# EAGLE design NixieModule_IN12 (EAGLE 9.1.3)
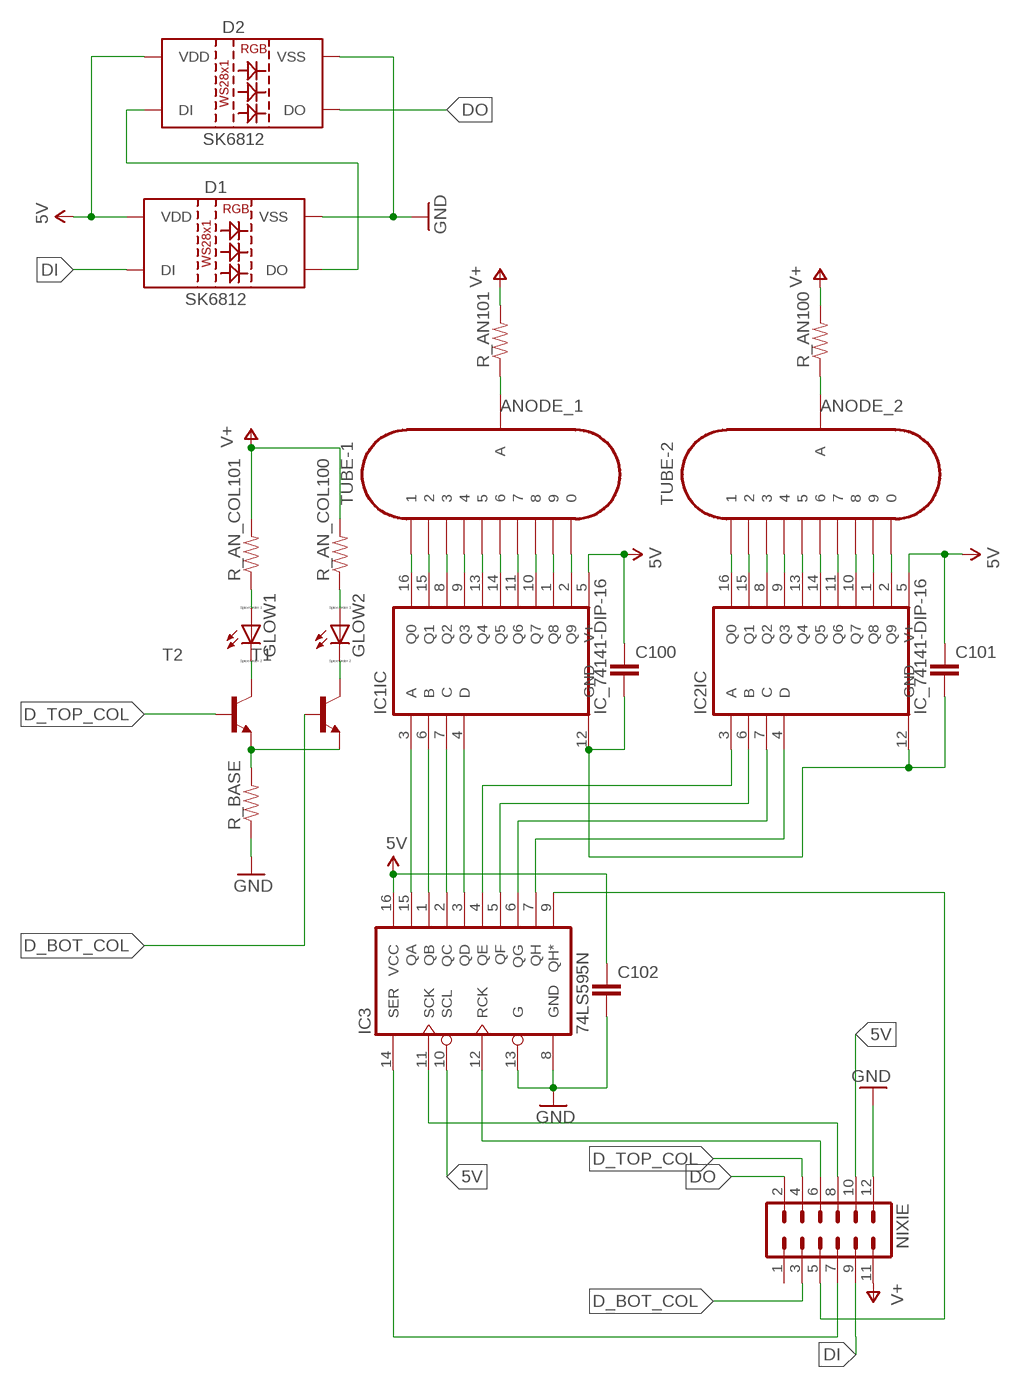
[diagram p0: schematic, sheet 1]

## Parts
C100  C-EU050-024X044  [C050-024X044]
C101  C-EU050-024X044  [C050-024X044]
C102  C-EU050-024X044  [C050-024X044]
D1  SK6812  WS2812B  [WS2812B]
D2  SK6812  WS2812B  [WS2812B]
GLOW1  LED_ELD260  [LED_LD260]
GLOW2  LED_ELD260  [LED_LD260]
IC1  IC_74141-DIP-16  [DIL16]
IC2  IC_74141-DIP-16  [DIL16]
IC3  74LS595N  [DIL16]
NIXIE  MA06-2  [MA06-2]
R_AN100  RESISTORPTH-1/4W  [AXIAL-0.4]
R_AN101  RESISTORPTH-1/4W  [AXIAL-0.4]
R_AN_COL100  RESISTORPTH-1/4W  [AXIAL-0.4]
R_AN_COL101  RESISTORPTH-1/4W  [AXIAL-0.4]
R_BASE  RESISTORPTH-1/4W  [AXIAL-0.4]
T1  -NPN-TO92-EBC  [TO92-EBC]
T2  -NPN-TO92-EBC  [TO92-EBC]
TUBE-1  IN-12A  [IN-12]
TUBE-2  IN-12A  [IN-12]

## Nets
5V: C100.1 C101.1 C102.1 D1.1(VDD) D2.1(VDD) IC1.5(SUPPLY:V+) IC2.5(SUPPLY:V+) IC3.10(SCL) IC3.16(VCC) NIXIE.10
ANODE_1 [High Voltage 170V]: R_AN101.P$1 TUBE-1.A
ANODE_2 [High Voltage 170V]: R_AN100.P$1 TUBE-2.A
D_BOT_COL: NIXIE.3 T1.B
D_TOP_COL: NIXIE.4 T2.B
DI: D1.4(DI) NIXIE.9
DO: D2.2(DO) NIXIE.2
GND [High Voltage 170V]: C100.2 C101.2 C102.2 D1.3(VSS) D2.3(VSS) IC1.12(SUPPLY:GND) IC2.12(SUPPLY:GND) IC3.8(GND) IC3.13(G) NIXIE.12 R_BASE.P$1
N$1: GLOW1.A R_AN_COL101.P$1
N$2: GLOW2.A R_AN_COL100.P$1
N$6: GLOW1.K(C) T2.C
N$7: IC1.16(IC:Q0) TUBE-1.1
N$8 [High Voltage 60V]: IC1.15(IC:Q1) TUBE-1.2
N$9 [High Voltage 60V]: IC1.8(IC:Q2) TUBE-1.3
N$10 [High Voltage 60V]: IC1.9(IC:Q3) TUBE-1.4
N$11 [High Voltage 60V]: IC1.13(IC:Q4) TUBE-1.5
N$12 [High Voltage 60V]: IC1.14(IC:Q5) TUBE-1.6
N$13 [High Voltage 60V]: IC1.11(IC:Q6) TUBE-1.7
N$14 [High Voltage 60V]: IC1.10(IC:Q7) TUBE-1.8
N$15 [High Voltage 60V]: IC1.1(IC:Q8) TUBE-1.9
N$16 [High Voltage 60V]: IC1.2(IC:Q9) TUBE-1.0
N$17: GLOW2.K(C) T1.C
N$18: R_BASE.P$2 T1.E T2.E
N$20 [High Voltage 60V]: IC2.9(IC:Q3) TUBE-2.4
N$21 [High Voltage 60V]: IC2.13(IC:Q4) TUBE-2.5
N$22 [High Voltage 60V]: IC2.14(IC:Q5) TUBE-2.6
N$23 [High Voltage 60V]: IC2.11(IC:Q6) TUBE-2.7
N$24 [High Voltage 60V]: IC2.10(IC:Q7) TUBE-2.8
N$25 [High Voltage 60V]: IC2.1(IC:Q8) TUBE-2.9
N$26 [High Voltage 60V]: IC2.2(IC:Q9) TUBE-2.0
N$27: D1.2(DO) D2.4(DI)
N$71: IC1.6(IC:B) IC3.1(QB)
N$72: IC1.7(IC:C) IC3.2(QC)
N$73: IC1.4(IC:D) IC3.3(QD)
N$74: IC1.3(IC:A) IC3.15(QA)
N$79: IC2.3(IC:A) IC3.4(QE)
N$80: IC2.6(IC:B) IC3.5(QF)
N$81: IC2.7(IC:C) IC3.6(QG)
N$82: IC2.4(IC:D) IC3.7(QH)
RCK: IC3.12(RCK) NIXIE.6
SCK: IC3.11(SCK) NIXIE.8
SERIAL_SHIFT_IN: IC3.14(SER) NIXIE.7
SERIAL_SHIFT_OUT: IC3.9(QH*) NIXIE.5
T2_1 [High Voltage 60V]: IC2.16(IC:Q0) TUBE-2.1
T2_2 [High Voltage 60V]: IC2.15(IC:Q1) TUBE-2.2
T2_3 [High Voltage 60V]: IC2.8(IC:Q2) TUBE-2.3
V+ [High Voltage 170V]: NIXIE.11 R_AN100.P$2 R_AN101.P$2 R_AN_COL100.P$2 R_AN_COL101.P$2
Unconnected: NIXIE.1

## Library data of the parts
C100-C102 = rcl:C-EU: CAPACITOR, European symbol; SPICEPREFIX: C
D1 D2 = SparkFun-LED:WS2812B: WS2812B SMD addressable RGB LED 5x5mm SMD LED with built-in controller IC. Color: Red/Green/Blue mC Rating: RGB: 390, 660, 180 mcd Forward Voltage: RGB: 2.0, 3.0, 3.0 V Packages:WS2812B SparkFun Products: Blynk Board - ESP8266 <https://www.sparkfun.com/products/13794>; PROD_ID: DIO-12503; VALUE: WS2812B
GLOW1 GLOW2 = eagle-ltspice:LED_E: LED Source: http://www.osram.convergy.de Source: www.luxeon.com Source: www.kingbright.com; SPICEMODEL: NONE; SPICEPREFIX: D; SPICETYPE: diode
IC1 IC2 = dp_devices:IC_74141: BCD to decimal decoder
IC3 = SparkFun:74*595: 8-bit SHIFT REGISTER, output latch
NIXIE = con-lstb:MA06-2: PIN HEADER; OC_FARNELL: unknown; OC_NEWARK: unknown
R_AN100 R_AN101 R_AN_COL100 R_AN_COL101 R_BASE = SparkFun:RESISTOR: Resistor Basic schematic elements and footprints for 0603, 1206, and PTH resistors.
T1 T2 = transistor:*-NPN-: NPN Transistror BF959 corrected 2008.03.06
TUBE-1 TUBE-2 = russian-nixies:IN-12A: IN-12A: medium numeric topview nixie tube

## Net classes
0 default: width 0.305 mm, clearance 0.305 mm
1 High Voltage 170V: width 0.61 mm, clearance 0.205 mm to class 0, clearance 0.61 mm
2 High Voltage 60V: width 0.406 mm, clearance 0.205 mm to class 0, clearance 0.205 mm to class 1, clearance 0.406 mm

## Board
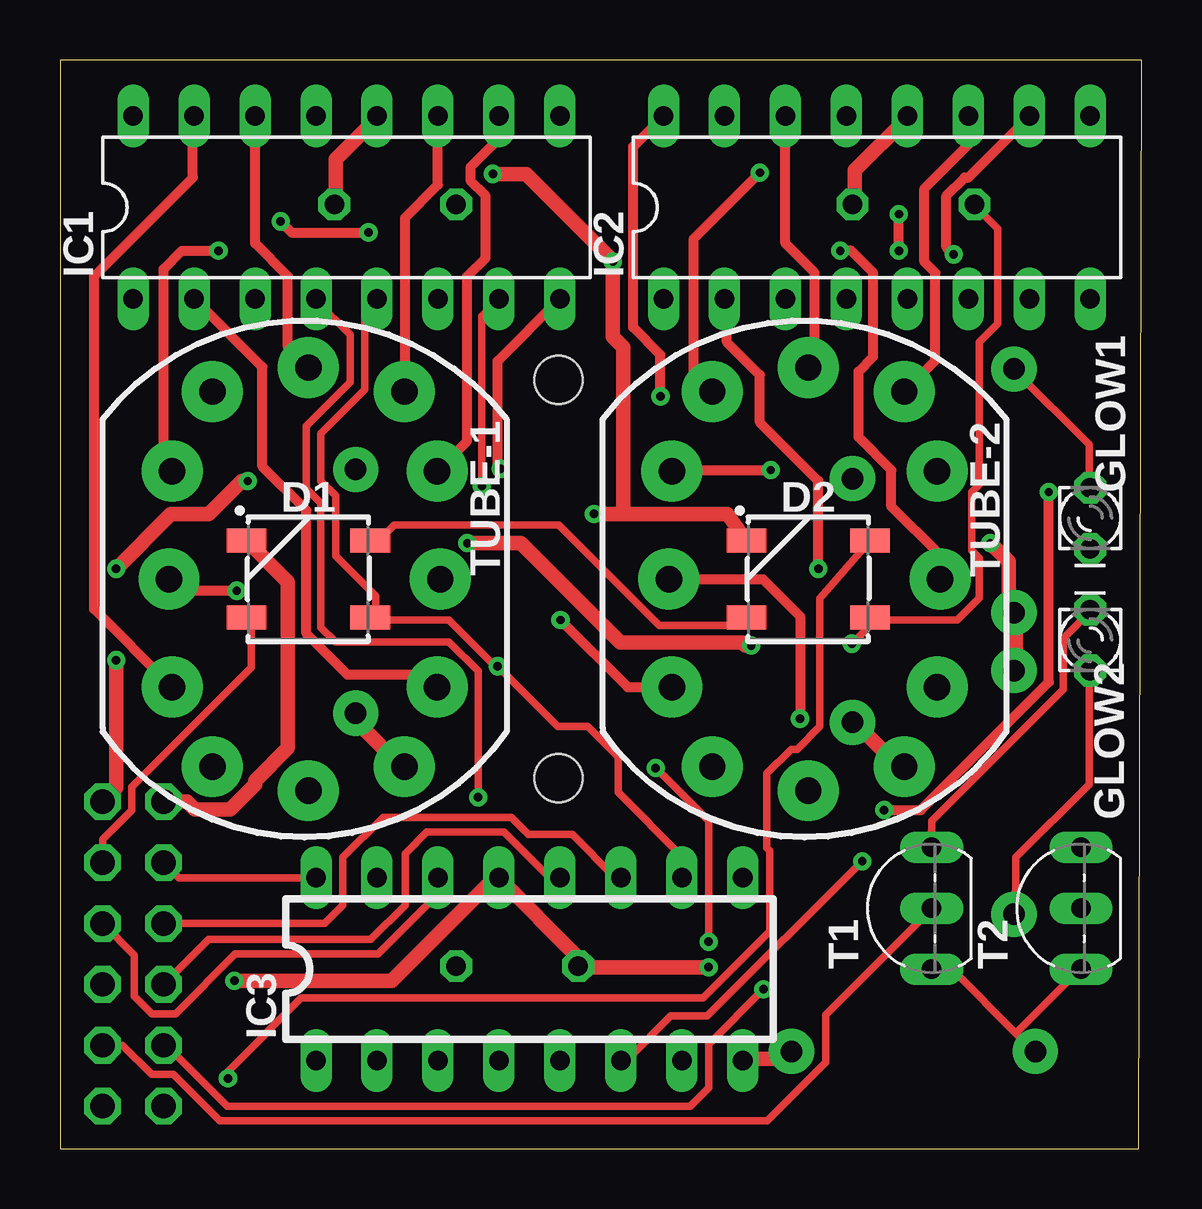
[diagram p1: board, top side]
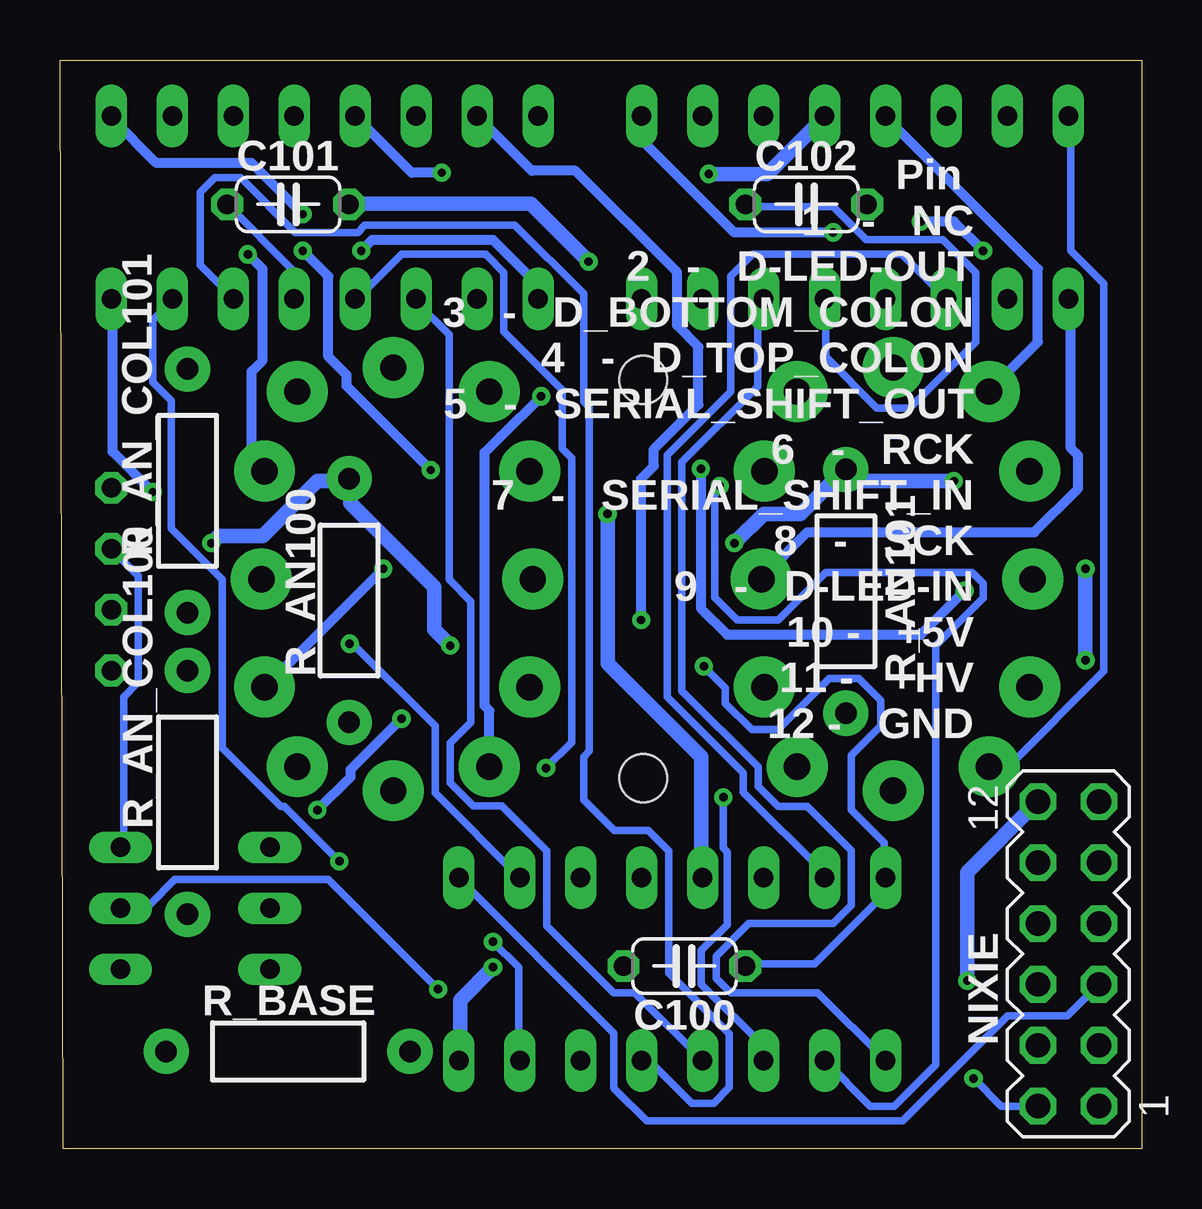
[diagram p2: board, bottom side, seen from below]

Size 45.06 x 45.39 mm. Coordinates in mm from the lower left corner, seen from the top.
Outline: 0,0 44.94,0 45.06,45.39 0,45.39 0,0
Copper layers (1*16): Top 0.035mm / dielectric 1.5mm / Bottom 0.035mm
Design rules "default": minimum track width 6mil, minimum drill 0.35mm, track to track 6mil, track to pad 6mil, pad to pad 6mil, via to via 6mil, smd to smd 6mil, copper to edge 40mil, drill to drill 6mil, minimum pad ring 10mil, minimum via ring 8mil, stop-mask expansion 4mil, vias tented up to drill 0mil, thermal gap 10mil
Holes 2 mm at 20.76,32.05 20.76,15.45

### Footprints (pad centres in the part's own frame; a part is rotated, then mirrored left to right if it is on the bottom)
C050-024X044 = drill 0.813 octagon: 1 -2.54,0; 2 2.54,0
WS2812B = smd 1.651 x 1: 1 2.577,-1.6; 2 2.577,1.6; 3 -2.577,1.6; 4 -2.577,-1.6
LED_LD260 = drill 0.813 octagon: A -1.27,0; K 1.27,0
DIL16 = drill 0.813 long: 1 -8.89,-3.81; 2 -6.35,-3.81; 3 -3.81,-3.81; 4 -1.27,-3.81; 5 1.27,-3.81; 6 3.81,-3.81; 7 6.35,-3.81; 8 8.89,-3.81; 9 8.89,3.81; 10 6.35,3.81; 11 3.81,3.81; 12 1.27,3.81; 13 -1.27,3.81; 14 -3.81,3.81; 15 -6.35,3.81; 16 -8.89,3.81
MA06-2 = drill 1.016 octagon: 1 -6.35,-1.27; 2 -6.35,1.27; 3 -3.81,-1.27; 4 -3.81,1.27; 5 -1.27,-1.27; 6 -1.27,1.27; 7 1.27,-1.27; 8 1.27,1.27; 9 3.81,-1.27; 10 3.81,1.27; 11 6.35,-1.27; 12 6.35,1.27
AXIAL-0.4 = drill 0.9 pad 1.88: P$1 -5.08,0; P$2 5.08,0
TO92-EBC = drill 0.813 long: B 0,-1.27; C 2.54,-1.27; E -2.54,-1.27
IN-12 = drill 1.1 pad 2.54: 0 5.048,-4.5; 1 -4.317,-7.817; 2 -6,-4.5; 3 -6.127,0; 4 -6,4.5; 5 -4.317,7.817; 6 -0.318,8.818; 7 3.683,7.817; 8 5.048,4.5; 9 5.175,0; A 3.683,-7.817; LHDP -0.318,-8.818

### Placement (x,y rotation side)
C100  19.05,7.62 180 bottom
C101  35.56,39.37 0 bottom
C102  13.97,39.37 0 bottom
D1  10.35,23.75 0 top
D2  31.18,23.75 0 top
GLOW1  42.93,26.29 270 top
GLOW2  42.93,21.21 90 top
IC1  11.94,39.24 0 top
IC2  34.04,39.24 0 top
IC3  19.56,7.49 0 top
NIXIE  3.05,8.13 90 bottom
R_AN100  33.02,22.86 90 bottom
R_AN101  12.32,23.24 90 bottom
R_AN_COL100  39.75,14.86 90 bottom
R_AN_COL101  39.75,27.43 270 bottom
R_BASE  35.56,4.06 180 bottom
T1  35.05,10.03 90 top
T2  41.27,10.03 90 top
TUBE-1  10.67,23.75 0 top
TUBE-2  31.5,23.75 0 top

### Tracks (layer width: path | path; a pad name or v marks a point on that pad's centre or on a via)
5V  (via drill 0.35)
  Top 0.305: C101.1 38.15,39.27 39.06,38.35 39.06,34.39 38.3,33.63 38.3,27.69 38,27.38 38,24.94 38.3,24.64 38.3,22.96 37.39,22.05 34.19,22.05 D2.1 34.04,22.05 33.98,22.05 v32.99,21.06 | IC1.5 13.16,35.31 12.7,34.85 12.7,31.65 10.87,29.82 10.87,27.84 11.48,27.23 11.48,24.71 13.16,23.04 13.16,22.2 D1.1 13.31,22.05 16.2,22.05 18.19,20.07 v18.24,20.12 20.74,17.62 21.98,17.62 23.25,16.35 23.25,14.85 25.91,12.19 IC3.10 | NIXIE.10 4.95,11.3 IC3.16
  Bottom 0.305: C101.1 35.41,36.68 35.41,35.46 IC2.5 | C100.1 16.51,7.72 13.61,7.72 10.72,10.62 10.72,11.23 IC3.16 10.72,11.38 10.72,12.75 12.09,14.12 12.09,16.41 10.87,17.63 10.87,18.69 11.79,19.61 13.01,19.61 15.14,17.48 16.24,17.48 17.34,18.57 17.34,19.22 v18.24,20.12 | C102.1 16.51,39.27 12.85,39.27 11.48,37.9 8.28,37.9 6.91,36.52 6.91,33.63 9.65,30.89 11.02,30.89 13.16,33.02 13.16,35.31 IC1.5 | IC3.10 29.44,14.83 29.44,17.63 32.87,21.06 v32.99,21.06
ANODE_1
  Top 0.61: R_AN101.P$1 12.39,18.09 12.39,17.78 14.22,15.95 TUBE-1.A
ANODE_2
  Top 0.61: R_AN100.P$1 33.12,17.78 35.1,15.8 TUBE-2.A
D_BOT_COL
  Top 0.305: T1.B 36.32,10.01 31.9,5.59 31.9,3.61 29.46,1.17 6.66,1.17 4.72,3.1 3.81,3.1 2.59,4.32 NIXIE.3
D_TOP_COL  (via drill 0.35)
  Top 0.305: v29.31,6.66 27.03,4.37 27.03,2.54 26.26,1.78 6.96,1.78 4.42,4.32 NIXIE.4
  Bottom 0.305: v29.31,6.66 33.88,11.23 40.28,11.23 41.35,10.16 42.42,10.16 T2.B
DI
  Top 0.305: D1.4 7.98,22.05 7.98,20.07 3,15.09 3,14.12 1.78,12.89 NIXIE.9
DO  (via drill 0.35)
  Top 0.305: D2.2 31.66,22.94 31.66,17.6 30.72,16.66 30.46,16.66 29.45,15.65 29.45,12.54 29.57,12.43 29.57,9.07 26.8,6.3 10.06,6.3 7,3.24 v7,2.94
  Bottom 0.305: v7,2.94 5.84,1.78 NIXIE.2
GND  (via drill 0.35)
  Top 0.61: C101.2 33.12,39.42 33.12,40.79 35.26,42.93 IC2.12 | C102.2 11.48,39.42 11.48,41.25 13.16,42.93 IC1.12 | IC3.8 28.55,3.76 30.07,3.76 30.38,4.06 R_BASE.P$1 | v22.25,26.47 22.45,26.47 23.09,26.47 23.47,26.47 | v27.03,7.57 21.84,7.57 C100.2 21.54,7.72 21.54,8.03 18.34,11.23 IC3.13 18.11,11.3 13.82,7.01 v7.26,7.01 | 23.47,26.47 23.47,33.43 23.04,33.86 v23.04,36.98 23.04,37.03 19.43,40.64 v18.03,40.64 | 23.47,26.47 27.8,26.47 D2.3 | NIXIE.12 5.29,14.48 5.61,14.15 7.09,14.15 8.13,15.19 8.13,15.34 9.5,16.71 9.5,23.62 D1.3
  Bottom 0.61: v27.03,7.57 28.4,6.2 28.4,3.76 IC3.8 | v18.03,40.64 15.6,40.64 13.31,42.93 IC1.12 | C101.2 32.99,39.4 25.45,39.4 v23.04,36.98 | v22.25,26.47 22.25,20.24 18.34,16.33 18.34,11.35 IC3.13 | NIXIE.12 7.26,11.53 v7.26,7.01
N$1
  Top 0.305: GLOW1.A 42.88,27.69 42.88,29.36 39.83,32.41 R_AN_COL101.P$1
N$2
  Top 0.305: GLOW2.A 42.88,19.91 42.88,15.19 39.83,12.14 39.83,9.86 R_AN_COL100.P$1
N$6
  Bottom 0.305: T2.C 42.42,12.6 42.42,18.85 41.81,19.46 41.81,23.88 42.88,24.94 GLOW1.K
N$7
  Bottom 0.305: IC1.16 2.95,42.93 2.95,37.44 1.57,36.07 1.57,19.91 5.54,15.95 6.3,15.95 TUBE-1.1
N$8
  Top 0.406: IC1.15 5.54,42.93 5.54,40.49 1.42,36.37 1.42,22.5 4.62,19.3 TUBE-1.2
N$9  (via drill 0.35)
  Top 0.406: v7.37,23.27 5.08,23.27 4.62,23.72 TUBE-1.3 | IC1.8 18.24,32.84 18.24,28.47 v18.36,28.35
  Bottom 0.406: v7.37,23.27 9.2,21.44 17.27,21.44 18.36,22.53 v18.36,28.35
N$10  (via drill 0.35)
  Top 0.406: v12.85,38.2 9.65,38.2 v9.2,38.66 | v6.6,37.44 5.08,37.44 4.32,36.68 4.32,28.6 4.62,28.3 TUBE-1.4
  Bottom 0.406: v12.85,38.2 16.97,38.2 20.78,42.01 20.78,42.93 IC1.9 | v9.2,38.66 7.82,38.66 v6.6,37.44
N$11
  Bottom 0.406: IC1.13 10.57,42.93 4.32,36.68 4.32,33.63 6.3,31.65 TUBE-1.5
N$12
  Top 0.406: IC1.14 8.13,37.74 9.5,36.37 9.5,33.42 TUBE-1.6
N$13
  Top 0.406: IC1.11 15.75,40.18 14.38,38.81 14.38,31.65 TUBE-1.7
N$14
  Top 0.406: IC1.10 18.19,42.93 18.19,42.01 17.12,40.95 17.12,40.34 17.73,39.73 17.73,37.13 16.97,36.37 16.97,29.52 15.75,28.3 TUBE-1.8
N$15
  Bottom 0.406: IC1.1 2.95,35.31 2.95,29.21 2.64,28.91 2.64,27.53 4.47,25.7 13.92,25.7 15.75,23.88 TUBE-1.9
N$16
  Top 0.406: TUBE-1.0 15.2,19.76 11.99,19.76 10.26,21.49 10.26,26.62 8.43,28.45 8.43,32.59 IC1.2
N$17
  Top 0.305: T1.C 36.32,13.66 41.81,19.15 41.81,21.29 42.88,22.35 GLOW2.K
N$18
  Top 0.305: 39.83,4.83 40.59,4.06 R_BASE.P$2 | 39.83,4.83 37.24,7.42 36.32,7.42 T1.E | 39.83,4.83 42.42,7.42 T2.E
N$20  (via drill 0.35)
  Top 0.406: v34.95,37.44 v34.95,38.96 | v29.62,28.3 25.5,28.3 TUBE-2.4
  Bottom 0.406: v34.95,38.96 37.08,41.1 41.05,41.1 42.88,42.93 IC2.9 | v34.95,37.44 33.88,36.37 33.88,33.02 33.12,32.26 33.12,31.8 v29.62,28.3
N$21  (via drill 0.35)
  Top 0.406: TUBE-2.5 27.18,31.65 26.42,32.41 26.42,37.95 v29.16,40.69
  Bottom 0.406: v29.16,40.69 30.4,40.69 IC2.13
N$22
  Top 0.406: IC2.14 30.23,37.74 31.45,36.52 31.45,32.87 31.29,32.72 TUBE-2.6
N$23
  Top 0.406: IC2.11 37.85,41.86 36.02,40.03 36.02,36.98 36.47,36.52 36.47,32.87 35.26,31.65 TUBE-2.7
N$24  (via drill 0.35)
  Top 0.406: v37.24,37.29 36.93,37.59 36.93,39.73 37.69,40.49 37.85,40.49 40.28,42.93 IC2.10
  Bottom 0.406: v37.24,37.29 36.63,36.68 36.63,32.87 37.08,32.41 37.08,28.75 36.63,28.3 TUBE-2.8
N$25  (via drill 0.35)
  Top 0.406: v32.51,37.44 32.97,37.44 33.88,36.52 33.88,33.02 33.27,32.41 33.27,29.67 34.65,28.3 34.65,26.77 36.63,24.79 36.63,23.88 TUBE-2.9
  Bottom 0.406: v32.51,37.44 32.05,37.9 27.03,37.9 25.2,36.07 25.2,35.46 IC2.1
N$26  (via drill 0.35)
  Top 0.406: v31.6,24.18 31.6,27.84 29.16,30.28 29.16,32.26 27.79,33.63 27.79,35.31 IC2.2
  Bottom 0.406: v31.6,24.18 36.47,19.3 TUBE-2.0
N$27
  Top 0.305: D1.2 13.31,25.4 13.92,26.01 20.78,26.01 24.97,21.82 28.59,21.82 D2.4
N$71
  Bottom 0.305: IC3.1 13.49,6.5 17.12,6.5 17.73,7.11 17.73,8.03 16.36,9.4 12.85,9.4 12.09,10.16 12.09,12.45 13.92,14.28 15.14,14.28 15.98,15.11 15.98,15.91 19.15,19.09 19.15,28.63 16,31.77 16,35.18 IC1.6
N$72  (via drill 0.35)
  Top 0.305: v17.58,27.64 17.58,34.72 IC1.7
  Bottom 0.305: IC3.2 11.3,1.78 10.31,1.78 8.59,3.5 8.59,20.98 6.6,22.96 6.6,23.57 7.06,24.03 13.16,24.03 15.14,22.05 16.84,22.05 17.78,22.99 17.78,27.43 v17.58,27.64
N$73  (via drill 0.35)
  Top 0.305: IC1.4 10.72,35.31 12.09,33.93 12.09,31.95 10.26,30.12 10.26,27.53 10.87,26.92 10.87,21.74 11.48,21.13 16.2,21.13 17.42,19.91 v17.42,14.65
  Bottom 0.305: v17.42,14.65 17.42,12.54 17.27,12.38 17.27,9.35 18.34,8.28 18.34,6.86 15.75,4.27 IC3.3
N$74
  Bottom 0.305: IC3.15 13.21,11.48 16.59,14.86 16.59,15.66 19.76,18.84 19.76,28.93 17.12,31.57 17.12,36.37 16.2,37.29 9.98,37.29 IC1.3
N$79
  Bottom 0.305: IC2.3 30.23,35.31 28.85,33.93 28.85,23.72 27.94,22.81 27.94,17.78 28.8,16.92 28.8,15.26 27.85,14.3 26.67,14.3 24.79,12.43 24.79,9.3 22,6.5 21.11,6.5 IC3.4
N$80
  Bottom 0.305: IC2.6 37.85,35.46 39.22,36.83 39.22,39.88 38.61,40.49 37.54,40.49 35.26,38.2 32.66,38.2 32.36,38.51 26.11,38.51 23.25,35.65 23.25,31.15 23.01,30.91 23.01,16.59 23.25,16.35 23.25,14.55 21.98,13.28 20.57,13.28 19.71,12.43 19.71,7.35 17.17,4.81 17.17,2.56 17.82,1.91 18.75,1.91 20.53,3.68 IC3.5
N$81  (via drill 0.35)
  Top 0.305: v33.43,11.99 26.98,5.54 25.45,5.54 23.67,3.76 23.37,3.76 IC3.6
  Bottom 0.305: v33.43,11.99 35.71,14.28 35.87,14.28 38.3,16.71 38.3,23.72 40.44,25.86 40.44,31.19 41.2,31.95 41.2,34.54 40.44,35.31 IC2.7
N$82  (via drill 0.35)
  Top 0.305: v27.03,8.64 27.03,13.66 v24.82,15.88
  Bottom 0.305: v27.03,8.64 25.96,7.57 25.96,3.73 IC3.7 | IC2.4 32.69,35.43 30.84,37.29 27.33,37.29 26.57,36.52 26.57,34.06 24.13,31.62 24.13,29.18 23.74,28.8 23.74,16.95 v24.82,15.88
RCK
  Top 0.305: IC3.12 20.75,11.38 20.32,11.38 18.49,13.21 15.29,13.21 14.38,12.29 14.38,10.16 12.95,8.74 6.2,8.74 NIXIE.6
SCK
  Top 0.305: IC3.11 23.14,11.3 21.34,13.11 19.51,13.11 18.8,13.82 13.46,13.82 11.79,12.14 11.79,10.16 11.02,9.4 NIXIE.8
SERIAL_SHIFT_IN
  Top 0.305: IC3.14 15.75,10.62 13.26,8.13 7.31,8.13 4.82,5.64 3.81,5.64 3.1,6.35 3.1,8.08 NIXIE.7
SERIAL_SHIFT_OUT
  Bottom 0.305: IC3.9 28.4,11.23 22,4.83 22,2.54 21.92,2.46 20.62,1.17 9.95,1.17 5.58,5.54 3.1,5.54 NIXIE.5
T2_1  (via drill 0.35)
  Top 0.406: v25.02,31.37 25.02,33.1 23.88,34.25 23.88,41.78 IC2.16
  Bottom 0.406: TUBE-2.1 27.18,18.27 27.38,18.47 27.38,29.03 26.68,29.72 26.67,29.72 v25.02,31.37
T2_2  (via drill 0.35)
  Top 0.406: v20.85,22.05 23.65,19.25 TUBE-2.2
  Bottom 0.406: v20.85,22.05 20.85,27.94 20.32,28.47 20.32,29.16 18.47,31.02 18.47,33.44 19.36,34.33 19.36,36.54 23.59,40.77 25.4,40.77 IC2.15
T2_3  (via drill 0.35)
  Top 0.406: v41.2,27.38 41.2,19.46 35.87,14.12 v34.34,14.12 | v30.84,17.93 30.84,22.2 29.29,23.75 TUBE-2.3
  Bottom 0.406: v41.2,27.38 42.88,29.06 42.88,35.31 IC2.8 | v34.34,14.12 32.97,15.49 32.97,15.8 v30.84,17.93
V+  (via drill 0.35)
  Top 0.61: R_AN_COL100.P$2 39.83,20.07 39.83,22.35 R_AN_COL101.P$2 39.52,22.5 39.52,24.49 v38.76,25.25 | v2.34,24.18 4.62,26.47 6.2,26.47 7.57,27.84 v7.82,27.84 | v16.97,25.25 19.2,25.25 23.34,21.11 28.42,21.11 28.55,20.98 v28.8,20.98 | v2.34,20.37 2.34,15.04 NIXIE.11
  Bottom 0.61: v38.76,25.25 38.46,25.55 36.63,25.55 34.34,27.84 33.12,27.84 R_AN100.P$2 32.97,27.89 32.97,26.92 29.46,23.42 29.46,21.64 v28.8,20.98 | v2.34,24.18 v2.34,20.37 | v7.82,27.84 11.79,27.84 12.24,28.3 R_AN101.P$2 12.55,28.14 14.22,26.47 15.75,26.47 v16.97,25.25

### Text on the board
bNames: Pin / 1 - NC / 2 - D-LED-OUT / 3 - D_BOTTOM_COLON / 4 - D_TOP_COLON / 5 - SERIAL_SHIFT_OUT / 6 - RCK / 7 - SERIAL_SHIFT_IN / 8 - SCK / 9 - D-LED-IN / 10 - +5V / 11 - +HV / 12 - GND
bDocu: NIXIE-MODULE IN-12, REV 1.0, CVG 26.05.19